# Altium project SpectrumAnalizer.PrjPcb (part 1 of 2)
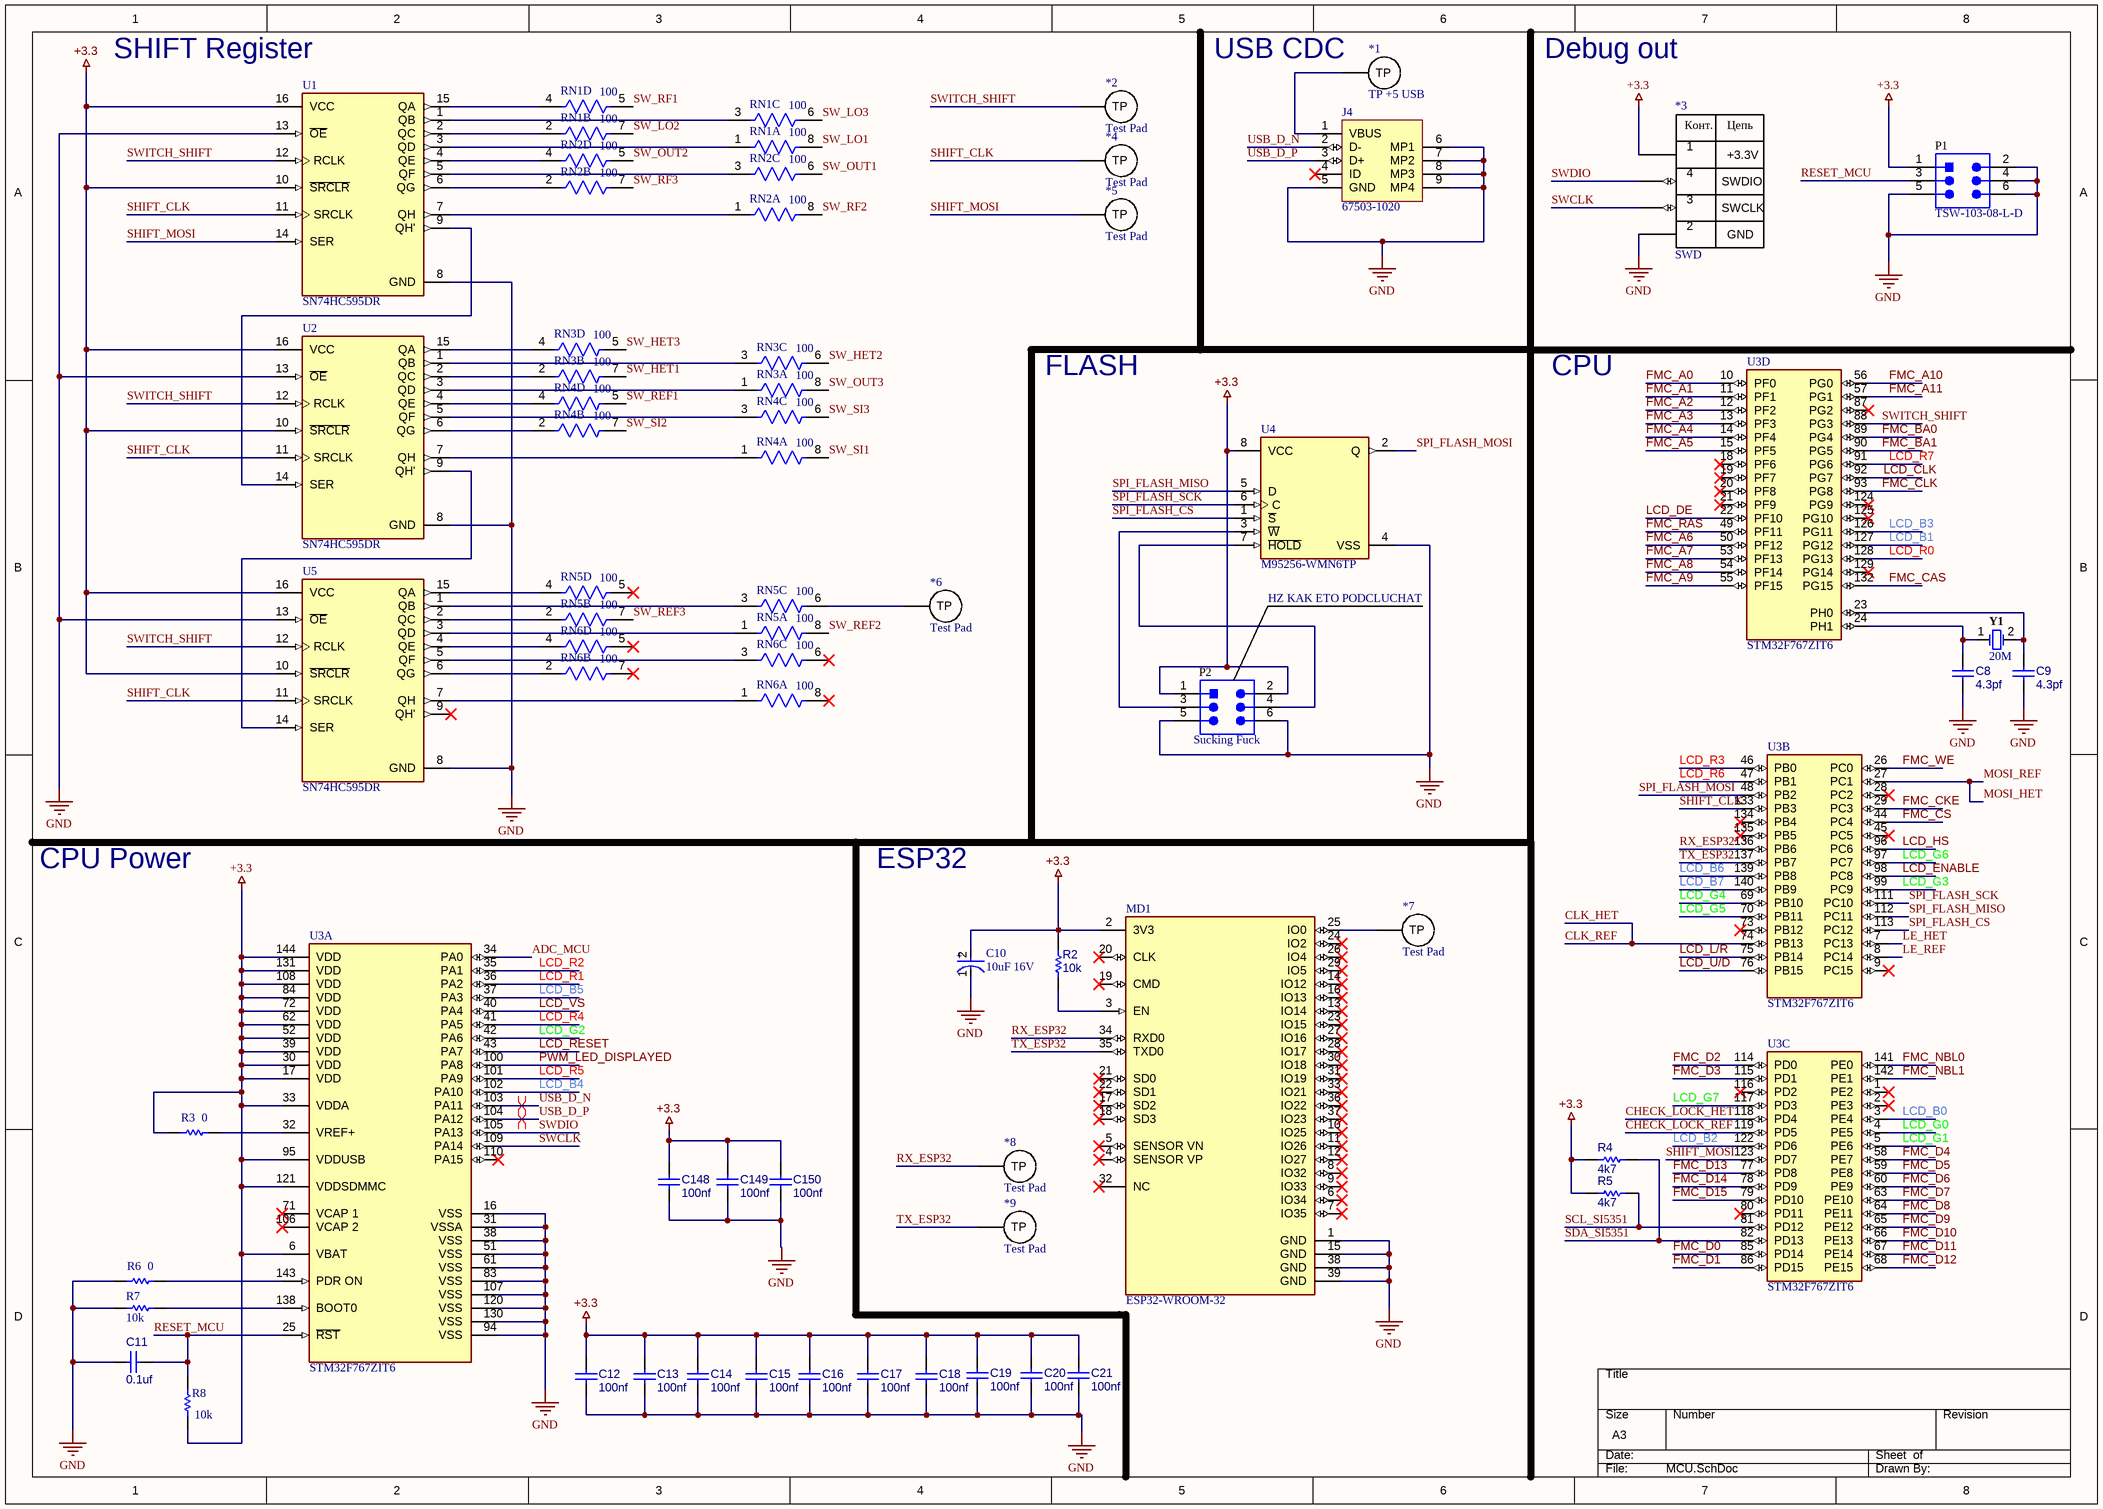
[diagram p0: MCU.SchDoc]
4 sheets, 289 parts. Net scope: global (net labels, ports and power ports of the same name join across sheets).
Board files: Main.PcbDoc, main Var2.PcbDoc
Sheets:
  MCU.SchDoc
  Power.SchDoc
  LCD.SchDoc
  Analog.SchDoc

## Sheet MCU.SchDoc
size A3

### Parts
*1  TP +5 USB  [Test Pad]
*2  Test Pad  [Test Pad]
*3  SWD  [PCBComponent_1]
*4  Test Pad  [Test Pad]
*5  Test Pad  [Test Pad]
*6  Test Pad  [Test Pad]
*7  Test Pad  [Test Pad]
*8  Test Pad  [Test Pad]
*9  Test Pad  [Test Pad]
C8  4.3pf  [CAPC2013X70X45NL10T25]
C9  4.3pf  [CAPC2013X70X45NL10T25]
C10  10uF 16V  [FP-TAJA-MFG]
C11  0.1uf  [CAPC2013X70X45NL10T25]
C12  100nf  [CAPC2013X70X45NL10T25]
C13  100nf  [CAPC2013X70X45NL10T25]
C14  100nf  [CAPC2013X70X45NL10T25]
C15  100nf  [CAPC2013X70X45NL10T25]
C16  100nf  [CAPC2013X70X45NL10T25]
C17  100nf  [CAPC2013X70X45NL10T25]
C18  100nf  [CAPC2013X70X45NL10T25]
C19  100nf  [CAPC2013X70X45NL10T25]
C20  100nf  [CAPC2013X70X45NL10T25]
C21  100nf  [CAPC2013X70X45NL10T25]
C148  100nf  [CAPC2013X70X45NL10T25]
C149  100nf  [CAPC2013X70X45NL10T25]
C150  100nf  [CAPC2013X70X45NL10T25]
J4  67503-1020  [MOLX-67503-1020_V]
MD1  ESP32-WROOM-32  [FP-ESP32-WROOM-32-MFG]
P1  TSW-103-08-L-D  [SMTC-TSW-103-08-L-D_V]
P2  Sucking Fuck  [SMTC-TSW-103-08-L-D_V]
R2  10k  [RESC2013X60X35ML10T20]
R3  0  [RESC2013X60X35ML10T20]
R4  4k7  [RESC2013X60X35ML10T20]
R5  4k7  [RESC2013X60X35ML10T20]
R6  0  [RESC2013X60X35ML10T20]
R7  10k  [RESC2013X60X35ML10T20]
R8  10k  [RESC2013X60X35ML10T20]
RN1  100  [FP-742C083-MFG]  (parts A,B,C,D of 4)
RN2  100  [FP-742C083-MFG]  (parts A,B,C,D of 4)
RN3  100  [FP-742C083-MFG]  (parts A,B,C,D of 4)
RN4  100  [FP-742C083-MFG]  (parts A,B,C,D of 4)
RN5  100  [FP-742C083-MFG]  (parts A,B,C,D of 4)
RN6  100  [FP-742C083-MFG]  (parts A,B,C,D of 4)
U1  SN74HC595DR  [FP-D0016A-MFG]
U2  SN74HC595DR  [FP-D0016A-MFG]
U3  STM32F767ZIT6  [FP-LQFP144-1A-MFG]  (parts A,B,C,D of 4)
U4  M95256-WMN6TP  [FP-SO8N-SO-A-MFG]
U5  SN74HC595DR  [FP-D0016A-MFG]
Y1  20M  [FOX-FOXSLF-2_V]

### Nets
+3.3: *3.1(+3.3V) C10.2(A) C12.2 C13.2 C14.2 C15.2 C16.2 C17.2 C18.2 C19.2 C20.2 C21.2 C148.2 C149.2 C150.2 MD1.2(3V3) P1.1 P2.1 P2.2 R2.2 R3.2 R4.2 R5.2 R8.1 U1.10(~{SRCLR}) U1.16(VCC) U2.10(~{SRCLR}) U2.16(VCC) U3.6(VBAT) U3.17(VDD) U3.30(VDD) U3.33(VDDA) U3.39(VDD) U3.52(VDD) U3.62(VDD) U3.72(VDD) U3.84(VDD) U3.95(VDDUSB) U3.108(VDD) U3.121(VDDSDMMC) U3.131(VDD) U3.144(VDD) U4.8(VCC) U5.10(~{SRCLR}) U5.16(VCC)
GND: *3.2(GND) C8.2 C9.2 C10.1(C) C11.2 C12.1 C13.1 C14.1 C15.1 C16.1 C17.1 C18.1 C19.1 C20.1 C21.1 C148.1 C149.1 C150.1 J4.5(GND) J4.6(MP1) J4.7(MP2) J4.8(MP3) J4.9(MP4) MD1.1(GND) MD1.15(GND) MD1.38(GND) MD1.39(GND) P1.2 P1.4 P1.5 P1.6 P2.5 P2.6 R6.2 R7.2 U1.8(GND) U1.13(~{OE}) U2.8(GND) U2.13(~{OE}) U3.16(VSS) U3.31(VSSA) U3.38(VSS) U3.51(VSS) U3.61(VSS) U3.83(VSS) U3.94(VSS) U3.107(VSS) U3.120(VSS) U3.130(VSS) U4.4(VSS) U5.8(GND) U5.13(~{OE})
ADC_MCU: U3.34(PA0)
CHECK_LOCK_HET: U3.118(PD4)
CHECK_LOCK_REF: U3.119(PD5)
CLK_HET: U3.74(PB13)  [also labelled CLK_REF]
FMC_A0: U3.10(PF0)
FMC_A1: U3.11(PF1)
FMC_A2: U3.12(PF2)
FMC_A3: U3.13(PF3)
FMC_A4: U3.14(PF4)
FMC_A5: U3.15(PF5)
FMC_A6: U3.50(PF12)
FMC_A7: U3.53(PF13)
FMC_A8: U3.54(PF14)
FMC_A9: U3.55(PF15)
FMC_A10: U3.56(PG0)
FMC_A11: U3.57(PG1)
FMC_BA0: U3.89(PG4)
FMC_BA1: U3.90(PG5)
FMC_CAS: U3.132(PG15)
FMC_CKE: U3.29(PC3)
FMC_CLK: U3.93(PG8)
FMC_CS: U3.44(PC4)
FMC_D0: U3.85(PD14)
FMC_D1: U3.86(PD15)
FMC_D2: U3.114(PD0)
FMC_D3: U3.115(PD1)
FMC_D4: U3.58(PE7)
FMC_D5: U3.59(PE8)
FMC_D6: U3.60(PE9)
FMC_D7: U3.63(PE10)
FMC_D8: U3.64(PE11)
FMC_D9: U3.65(PE12)
FMC_D10: U3.66(PE13)
FMC_D11: U3.67(PE14)
FMC_D12: U3.68(PE15)
FMC_D13: U3.77(PD8)
FMC_D14: U3.78(PD9)
FMC_D15: U3.79(PD10)
FMC_NBL0: U3.141(PE0)
FMC_NBL1: U3.142(PE1)
FMC_RAS: U3.49(PF11)
FMC_WE: U3.26(PC0)
LCD_B0: U3.3(PE4)
LCD_B1: U3.127(PG12)
LCD_B2: U3.122(PD6)
LCD_B3: U3.126(PG11)
LCD_B4: U3.102(PA10)
LCD_B5: U3.37(PA3)
LCD_B6: U3.139(PB8)
LCD_B7: U3.140(PB9)
LCD_CLK: U3.92(PG7)
LCD_DE: U3.22(PF10)
LCD_ENABLE: U3.98(PC8)
LCD_G0: U3.4(PE5)
LCD_G1: U3.5(PE6)
LCD_G2: U3.42(PA6)
LCD_G3: U3.99(PC9)
LCD_G4: U3.69(PB10)
LCD_G5: U3.70(PB11)
LCD_G6: U3.97(PC7)
LCD_G7: U3.117(PD3)
LCD_HS: U3.96(PC6)
LCD_L/R: U3.75(PB14)
LCD_R0: U3.128(PG13)
LCD_R1: U3.36(PA2)
LCD_R2: U3.35(PA1)
LCD_R3: U3.46(PB0)
LCD_R4: U3.41(PA5)
LCD_R5: U3.101(PA9)
LCD_R6: U3.47(PB1)
LCD_R7: U3.91(PG6)
LCD_RESET: U3.43(PA7)
LCD_U/D: U3.76(PB15)
LCD_VS: U3.40(PA4)
LE_HET: U3.7(PC13)
LE_REF: U3.8(PC14)
MOSI_HET: U3.27(PC1)  [also labelled MOSI_REF]
PWM_LED_DISPLAYED: U3.100(PA8)
RESET_MCU: C11.1 P1.3 R8.2 U3.25(~{RST})
RX_ESP32: *8.1(TP) MD1.34(RXD0) U3.136(PB6)
SCL_SI5351: R5.1 U3.81(PD12)
SDA_SI5351: R4.1 U3.82(PD13)
SHIFT_CLK: *4.1(TP) U1.11(SRCLK) U2.11(SRCLK) U3.133(PB3) U5.11(SRCLK)
SHIFT_MOSI: *5.1(TP) U1.14(SER) U3.123(PD7)
SPI_FLASH_CS: U3.113(PC12) U4.1(~{S})
SPI_FLASH_MISO: U3.112(PC11) U4.5(D)
SPI_FLASH_MOSI: U3.48(PB2) U4.2(Q)
SPI_FLASH_SCK: U3.111(PC10) U4.6(C)
SW_HET1: RN3.7
SW_HET2: RN3.6
SW_HET3: RN3.5
SW_LO1: RN1.8
SW_LO2: RN1.7
SW_LO3: RN1.6
SW_OUT1: RN2.6
SW_OUT2: RN2.5
SW_OUT3: RN3.8
SW_REF1: RN4.5
SW_REF2: RN5.8
SW_REF3: RN5.7
SW_RF1: RN1.5
SW_RF2: RN2.8
SW_RF3: RN2.7
SW_SI1: RN4.8
SW_SI2: RN4.7
SW_SI3: RN4.6
SWCLK: *3.3(SWCLK) U3.109(PA14)
SWDIO: *3.4(SWDIO) U3.105(PA13)
SWITCH_SHIFT: *2.1(TP) U1.12(RCLK) U2.12(RCLK) U3.88(PG3) U5.12(RCLK)
TX_ESP32: *9.1(TP) MD1.35(TXD0) U3.137(PB7)
USB_D_N: J4.2(D-) U3.103(PA11)
USB_D_P: J4.3(D+) U3.104(PA12)
Net*1_1: *1.1(TP) J4.1(VBUS)
Net*6_1: *6.1(TP) RN5.6
Net*7_1: *7.1(TP) MD1.25(IO0)
NetC8_1: C8.1 U3.24(PH1) Y1.1
NetC9_1: C9.1 U3.23(PH0) Y1.2
NetMD1_3: MD1.3(EN) R2.1
NetP2_3: P2.3 U4.3(~{W})
NetP2_4: P2.4 U4.7(~{HOLD})
NetR3_1: R3.1 U3.32(VREF+)
NetR6_1: R6.1 U3.143(PDR_ON)
NetR7_1: R7.1 U3.138(BOOT0)
NetRN1_1: RN1.1 U1.3(QD)
NetRN1_2: RN1.2 U1.2(QC)
NetRN1_3: RN1.3 U1.1(QB)
NetRN1_4: RN1.4 U1.15(QA)
NetRN2_1: RN2.1 U1.7(QH)
NetRN2_2: RN2.2 U1.6(QG)
NetRN2_3: RN2.3 U1.5(QF)
NetRN2_4: RN2.4 U1.4(QE)
NetRN3_1: RN3.1 U2.3(QD)
NetRN3_2: RN3.2 U2.2(QC)
NetRN3_3: RN3.3 U2.1(QB)
NetRN3_4: RN3.4 U2.15(QA)
NetRN4_1: RN4.1 U2.7(QH)
NetRN4_2: RN4.2 U2.6(QG)
NetRN4_3: RN4.3 U2.5(QF)
NetRN4_4: RN4.4 U2.4(QE)
NetRN5_1: RN5.1 U5.3(QD)
NetRN5_2: RN5.2 U5.2(QC)
NetRN5_3: RN5.3 U5.1(QB)
NetRN5_4: RN5.4 U5.15(QA)
NetRN6_1: RN6.1 U5.7(QH)
NetRN6_2: RN6.2 U5.6(QG)
NetRN6_3: RN6.3 U5.5(QF)
NetRN6_4: RN6.4 U5.4(QE)
NetU1_9: U1.9(QH') U2.14(SER)
NetU2_9: U2.9(QH') U5.14(SER)

Not connected (* = marked no-connect by the designer): J4 4(ID)*; MD1 4(SENSOR_VP)* 5(SENSOR_VN)* 6(IO34)* 7(IO35)* 8(IO32)* 9(IO33)* 10(IO25)* 11(IO26)* 12(IO27)* 13(IO14)* 14(IO12)* 16(IO13)* 17(SD2)* 18(SD3)* 19(CMD)* 20(CLK)* 21(SD0)* 22(SD1)* 23(IO15)* 24(IO2)* 26(IO4)* 27(IO16)* 28(IO17)* 29(IO5)* 30(IO18)* 31(IO19)* 32(NC)* 33(IO21)* 36(IO22)* 37(IO23)*; RN5 5*; RN6 5* 6* 7* 8*; U3 1(PE2)* 2(PE3)* 9(PC15)* 18(PF6)* 19(PF7)* 20(PF8)* 21(PF9)* 28(PC2)* 45(PC5)* 71(VCAP_1)* 73(PB12)* 80(PD11)* 87(PG2)* 106(VCAP_2)* 110(PA15)* 116(PD2)* 124(PG9)* 125(PG10)* 129(PG14)* 134(PB4)* 135(PB5)*; U5 9(QH')*

### Layout directives
differential pair: USB_D_N, USB_D_P

### Notes on the sheet
- (near U1) SHIFT Register
- USB CDC
- Debug out
- FLASH
- CPU
- (near U4) HZ KAK ETO PODCLUCHAT
- CPU Power
- ESP32
- (in symbol CMP-04424-000155-1) +
- (in symbol SWD) Конт.; Цепь

### Library data of the parts
*1 = Test Pad
C8 C9 C11-C21 C148-C150 = CMP-2007-00957-1: Part Number: GRM216R61E105KA12D; Manufacturer: Murata
C10 = CMP-04424-000155-1: 3.3uF 25V  ±20% 3.7Ω 1206  SMD Tantalum Capacitor; Dissipation Factor: 6%; Leakage Current: 800nA; Polarity: Polar; ESR (Equivalent Series Resistance): 3.7R; Height - Seated (Max): 0.071inch; Mount: Surface Mount; Packaging: Tape and Reel; Case Code (Metric): 3216; RoHS Compliant: Yes; Tolerance: 20%; Voltage Rating (DC): 25V; Voltage Rating: 25V; Weight: 0.000571oz; Package Quantity: 2000; Series: TAJ; Height: 1.8mm; Case/Package: 1206; Capacitance: 3.3uF; Number of Pins: 2; Max Operating Temperature: 125°C; Construction: Flat; Width: 1.6mm; Lead Free: Lead Free; Depth: 1.6mm; Termination: SMD/SMT; Min Operating Temperature: -55°C; Case Code (Imperial): 1206; Length: 3.2mm; Radiation Hardening: No; Features: General Purpose
J4 = CMP-0411-00002-1: USB, MINI, SMD, RA KME04-USBMU03A01; Manufacturer: Molex; ComponentLink1URL: http://www.molex.com/; PartNumber: 67503-1020; Mounting Technology: Surface Mount; ComponentLink1Description: Manufacturer URL; Terminal Pitch: 0.8 mm; DatasheetVersion: Rev F, 06/2009; ComponentLink2Description: Datasheet; PackageDescription: Mini USB Connector, SMT, Righer Angle; ComponentLink2URL: http://www.molex.com/pdm_docs/sd/675031020_sd.pdf; PackageReference: 67503-1020
MD1 = CMP-194065-000008-1: RX TXRX MOD WIFI SURFACE MOUNT; Frequency: 2.5GHz; Sensitivity: -98dBm; Operating Supply Voltage: 3.6V; Data Rate: 150Mbps; Weight: 0.088185oz; Package Quantity: 550; Min Operating Temperature: -40°C; Mount: Surface Mount; Max Operating Temperature: 85°C; Packaging: Cut Tape; Case/Package: SMD/SMT
P1 P2 = CMP-1024-00336-5: Male Header, Pitch 2.54 mm, 2 x 3 Position, Height 8.38 mm, Tail Length 5.08 mm, -55 to 125 degC, RoHS, Bulk; Manufacturer: Samtec; DatasheetVersion: 04/2012; ComponentLink3URL: http://suddendocs.samtec.com/prints/tsw-xxx-xx-x-x-xx-xxx-footprint.pdf; PackageReference: TSW-103-08-L-D; Mounting Technology: Through Hole; Min Operating Temperature: -55 degC; ComponentLink2Description: Datasheet; Lead Pitch: 2.54 mm; ComponentLink1Description: Manufacturer URL; Mount: Through Hole; ComponentLink1URL: http://www.samtec.com/; ComponentLink3Description: Package Specification; Max Operating Temperature: 125 degC; PackageDescription: Male Header, Pitch 2.54 mm, 2 x 3 Position, Height 8.38 mm, Tail Length 5.08 mm; ComponentLink2URL: https://datasheet.ciiva.com/25618/0900766b81154476-25618436.pdf; RoHSCompliant: true
R2-R8 = CMP-2100-03671-1: Chip Resistor, 1 KOhm, +/- 1%, 125 mW, -55 to 155 degC, 0805 (2012 Metric), RoHS, Tape and Reel; Manufacturer: Yageo; Temperature Coefficient: 100ppm/degreesC; Voltage Rating (DC): 150V; Max Power Dissipation: 125mW; Resistance: 1KOhm; Number of Pins: 2; Number of Terminations: 2; Datasheet URL: http://www.yageo.com/NewPortal/yageodocoutput?fileName=/pdf/R-Chip/PYu-RC_Group_51_RoHS_L_5.pdf; Length: 0.079inch; Package Description: 2-Pin Surface Mounted Device, Body 2 x 1.25 mm; Depth: 1.25mm; Height: 0.024inch; Military Standard: Not; Case/Package: 0805; Package Reference: 0805; RoHSCompliant: true; Lead Free: LeadFree; Packaging: TapeandReel; Package Quantity: 1; Datasheet Version: Rev. 5, 10/2016; Tolerance: 1%; Min Operating Temperature: -55degC; Voltage Rating: 150V; Composition: ThickFilm; Case Code (Imperial): 0805; Power Rating: 125mW; Width: 0.049inch; Case Code (Metric): 2012; Manufacturer URL: http://www.yageo.com/; Max Operating Temperature: 155degC; REACH SVHC: Unknown; Termination: SMD/SMT
RN1-RN6 = CMP-06828-000007-1: RES ARRAY 4 RES 22 OHM 1206; Power Dissipation: 63mW; Tolerance: 5%; Resistance: 22R; Number of Resistors: 4; Voltage Rating: 50V; Circuit Type: Isolated; Power Rating: 250mW; Temperature Coefficient: 200ppm/°C; Depth: 1.6mm; Number of Terminals: 8; Contact Plating: Tin; Height: 0.6mm; Terminal Pitch: 0.8mm; Mount: Surface Mount; Min Operating Temperature: -55°C; Military Standard: Not; Power Per Element: 63mW; Max Operating Temperature: 125°C; Length: 3.2mm; Number of Elements: 4; Package Quantity: 5000; Number of Pins: 8; Radiation Hardening: No; Packaging: Tape and Reel; Termination: Concave; Lead Free: Lead Free; Case/Package: Molded
U1 U2 U5 = CMP-0780-00037-4: IC 8BIT SHIFT REG 3ST-OUT 16SOIC; Manufacturer: Texas Instruments; Max Supply Voltage: 6V; Nominal Supply Current: 80uA; Number Of Circuits: 1; Max Junction Temp: +150°C; Propagation Delay: 43ns; Frequency: 29MHz; Min Supply Voltage: 2V; Standoff Height: 0.1mm; Number Of Outputs: 9; Height: 1.75mm; Automotive: No; Device Class L1: Integrated Circuits (ICs); ComponentLink2Description: Datasheet; Ambient Temperature Range Low: -40°C; Ambient Temperature Range High: +85°C; Digikey Description: IC 8BIT SHIFT REG 3ST-OUT 16SOIC; ComponentLink2URL: http://www.ti.com/lit/ds/symlink/sn74hc595.pdf; Package: D0016A; Lead Free: Yes; Manufacturer Part Number: SN74HC595DR; Device Class L3: Shift Registers; Category: IC; Number Of Inputs: 1; Octopart: https://octopart.com/sn74hc595dr-texas+instruments-500634; Ipc Land Pattern Name: SOIC127P600X175-16; Device Class L2: Logic ICs; Temperature Range Low: -40°C; RoHS: TRUE; Temperature: -40°C to +85°C; Temperature Range High: +85°C; Mouser Description: Counter Shift Registers 8bit Shift
U3 = CMP-12105-000074-1: IC MCU 32BIT 2MB FLASH 144LQFP; Manufacturer: STMicroelectronics; Ram Size: 512KBytes; Number Of I/Os: 114; Core Architecture: ARM Cortex-M7; Memory Size: 2048KBytes; Standoff Height: 0.05mm; Number Of Adc Channels: 24; Max Supply Voltage: 3.6V; Number Of Pwm Channels: 4; Min Supply Voltage: 1.7V; Max Junction Temp: +105°C; Number Of Timers/Counters: 15; Number Of Usb Channels: 1; Interface: I2C,SPI,UART,USART,EBI/EMI,CAN,USB,LIN,IrDA,Ethernet,I2S; Frequency: 216MHz; Data Bus Width: 32bits; Number Of Spi Channels: 6; Number Of A/D Converters: 3; Octopart: https://octopart.com/stm32f767zit6-stmicroelectronics-70527068; Category: IC; Device Class L2: Embedded Processors and Controllers; Package: LQFP144-1A; RoHS: TRUE; Digikey Description: IC MCU 32BIT 2MB FLASH 144LQFP; ComponentLink2Description: Datasheet; Automotive: No; Mouser Description: ARM Microcontrollers - MCU High-performance and DSP with FPU, ARM Cortex-M7 MCU with 2 Mbytes Flash, 216 MHz CPU, Art Accelerator, L1 cache, SDRAM,; Ambient Temperature Range Low: -40°C; Ambient Temperature Range High: +85°C; Memory Type: FLASH; ComponentLink2URL: https://www.st.com/resource/en/datasheet/stm32f767zi.pdf; Number Of Uart Channels: 4; Temperature: -40°C to +85°C; Device Class L3: Microcontrollers; Device Class L1: Integrated Circuits (ICs); Temperature Range Low: -40°C; Temperature Range High: +85°C; Lead Free: Yes; Number Of I2C Channels: 4; Number Of Ethernet Channels: 1; Height: 1.6mm; Number Of Cores: 1; Manufacturer Part Number: STM32F767ZIT6; Ipc Land Pattern Name: QFP50P2200X2200X160-144
U4 = CMP-12142-000008-1: IC EEPROM 256K SPI 20MHZ 8SO; Manufacturer: STMicroelectronics; Memory Size: 256Kbits; Max Supply Voltage: 5.5V; Min Supply Voltage: 2.5V; Access Time: 60ns; Nominal Supply Current: 2-5mA; Standoff Height: 0.1mm; Package: SO8N-SO-A; Height: 1.75mm; Ipc Land Pattern Name: SOIC127P600X175-8; Lead Free: Yes; Device Class L3: EEPROM; Octopart: https://octopart.com/m95256-wmn6tp-stmicroelectronics-842801; Automotive: No; ComponentLink2Description: Datasheet; Frequency: 20MHz; Device Class L2: Memory; Temperature Range Low: -40°C; Temperature: -40°C to +85°C; Device Class L1: Integrated Circuits (ICs); Memory Type: EEPROM; Ambient Temperature Range High: +85°C; Digikey Description: IC EEPROM 256K SPI 20MHZ 8SO; ComponentLink2URL: https://www.st.com/resource/en/datasheet/m95256-w.pdf; Interface: SPI; Temperature Range High: +85°C; Manufacturer Part Number: M95256-WMN6TP; Mouser Description: EEPROM 2.5 V to 5.5V 256k; Ambient Temperature Range Low: -40°C; RoHS: TRUE; Category: IC
Y1 = CMP-1749-00004-1: Resistance Weld Thru-Hole Crystal, 12 MHz, +/-30 ppm, -20 to 70 degC, 2-Pin THD, RoHS, Bulk; Elements: 1; Rds On Max: 115 mohm; Typical Rise Time: 90 ns; Max Power Dissipation: 2.5 W; Case\Package: TO-251-3; Input Capacitance: 350 pF; REACH SVHC: No SVHC; Length: 6.6 mm; ComponentLink1URL: http://www.foxonline.com/; PackageDescription: 2-Pin Through Hole Device, Body 11.35 x 4.65 mm, Pitch 4.88 mm; Radiation Hardening: No; Package Quantity: 70; Packaging: Rail/Tube; ComponentLink1Description: Manufacturer URL; Min Operating Temperature: -55 degC; Max Operating Temperature: 150 degC; RoHSCompliant: true; PackageReference: FOXSLF-2; DatasheetVersion: Mar-15; Pins: 3; Height: 6.1 mm; Mount: Through Hole; ComponentLink2URL: http://www.foxonline.com/pdfs/hc49slf.pdf; ComponentLink2Description: Datasheet; Width: 2.3 mm

## Sheet Power.SchDoc
size A3
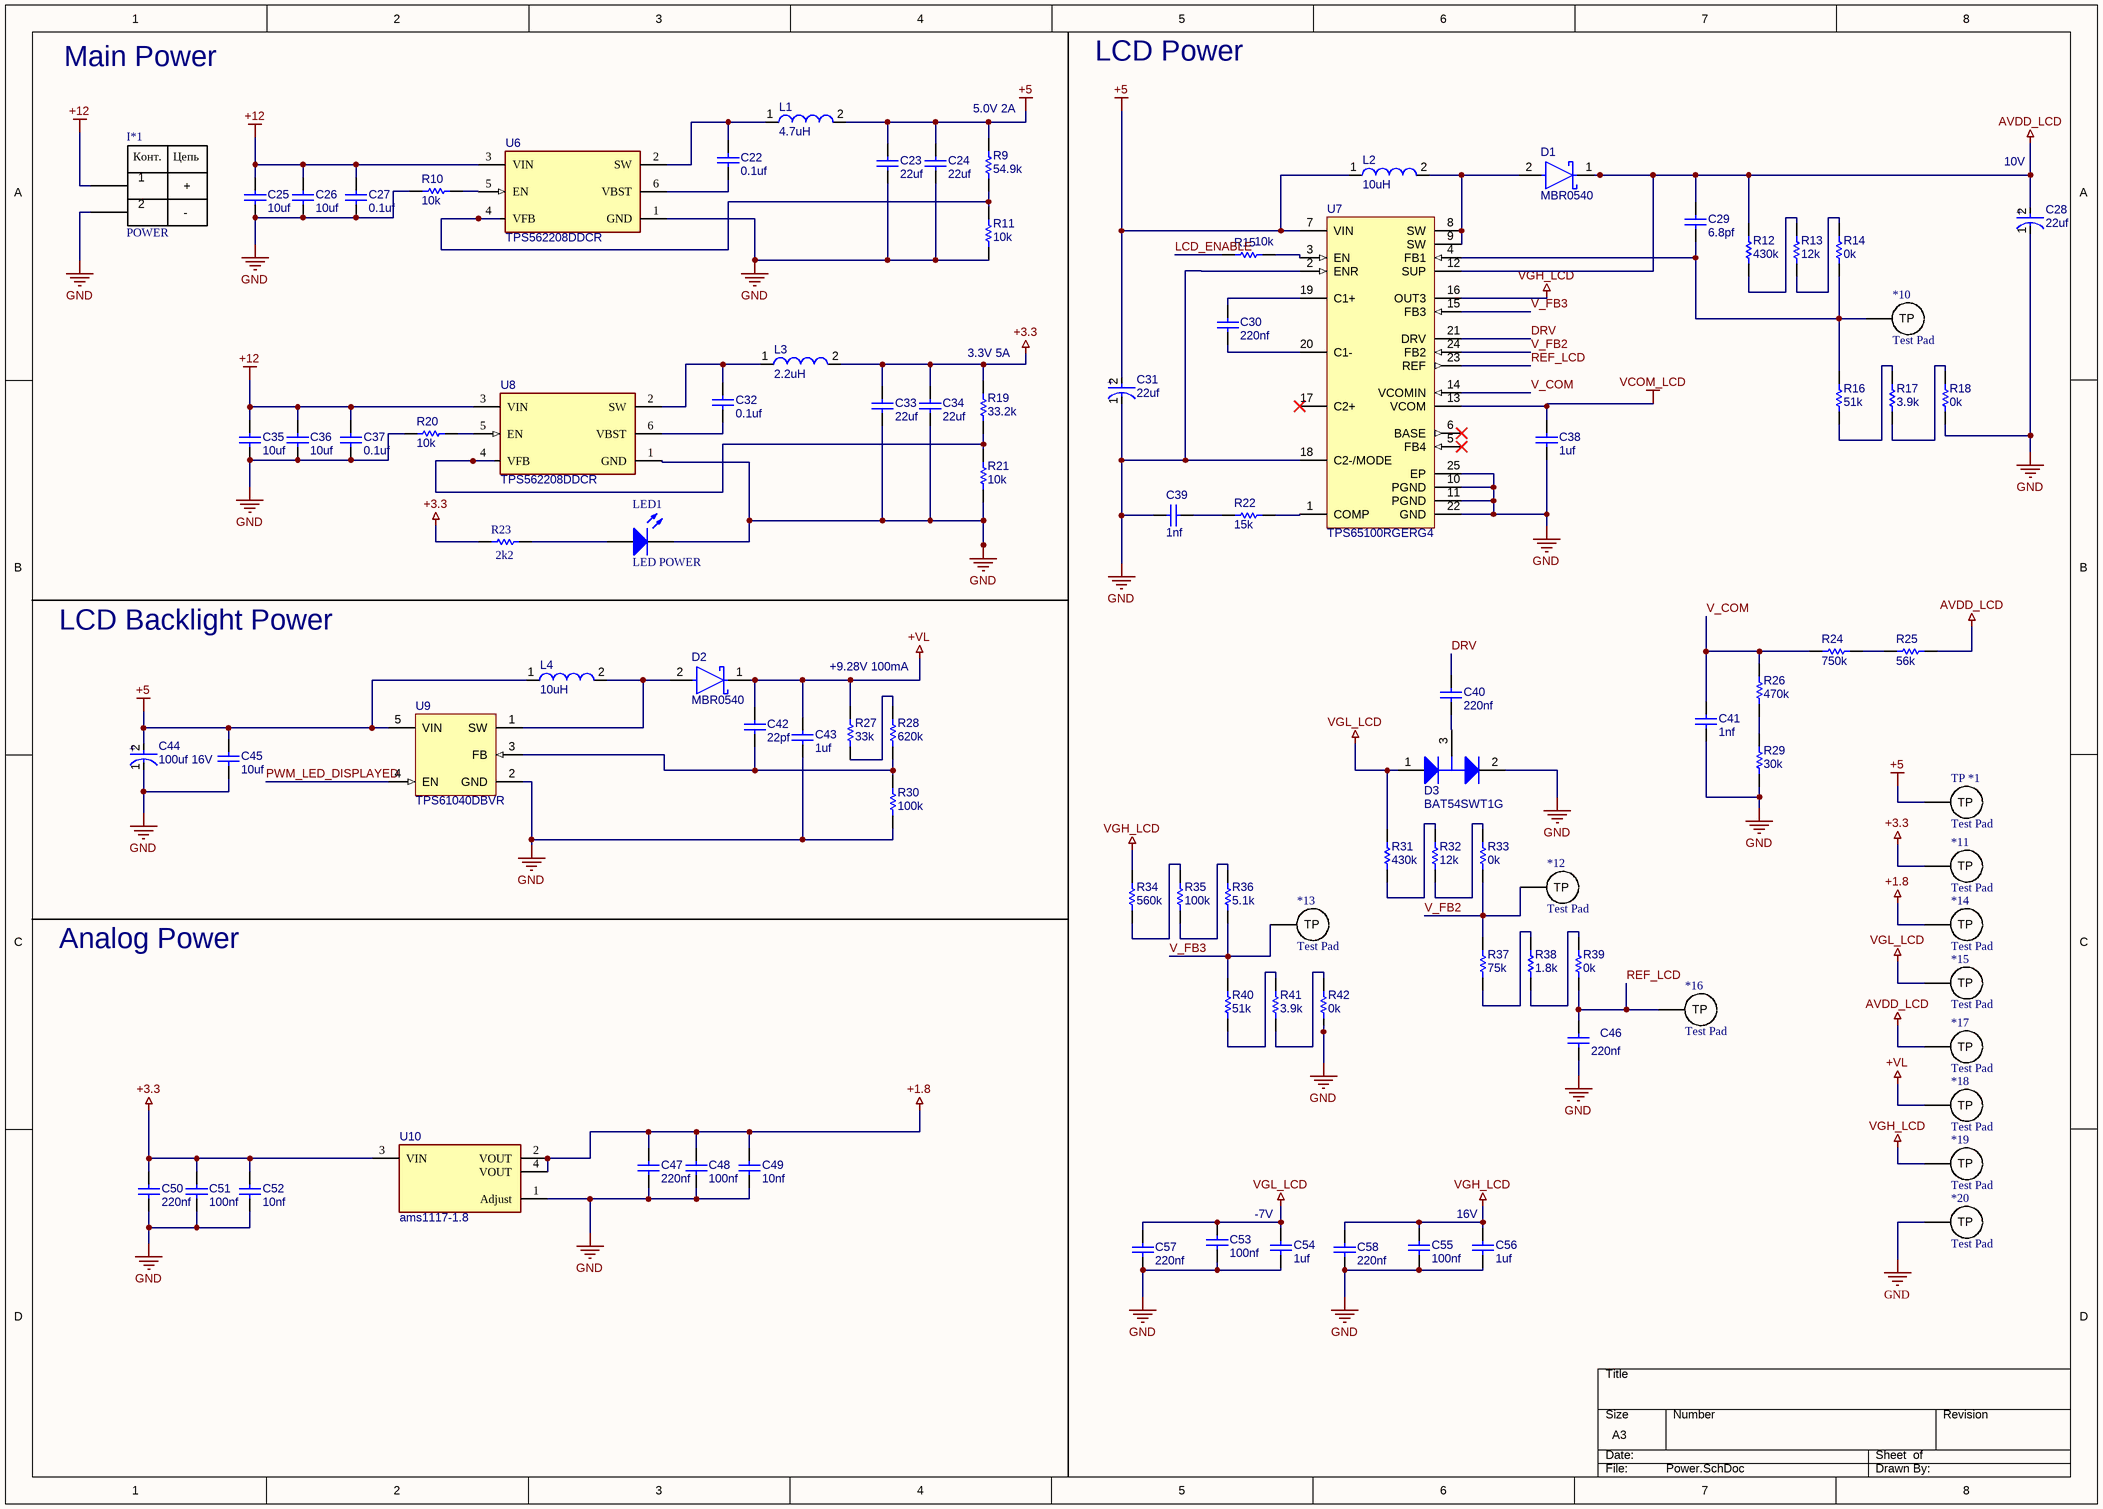
[diagram p1: Power.SchDoc]

### Parts
*10  Test Pad  [Test Pad]
*11  Test Pad  [Test Pad]
*12  Test Pad  [Test Pad]
*13  Test Pad  [Test Pad]
*14  Test Pad  [Test Pad]
*15  Test Pad  [Test Pad]
*16  Test Pad  [Test Pad]
*17  Test Pad  [Test Pad]
*18  Test Pad  [Test Pad]
*19  Test Pad  [Test Pad]
*20  Test Pad  [Test Pad]
C22  0.1uf  [CAPC2013X70X45NL10T25]
C23  22uf  [CAPC2013X70X45NL10T25]
C24  22uf  [CAPC2013X70X45NL10T25]
C25  10uf  [CAPC2013X70X45NL10T25]
C26  10uf  [CAPC2013X70X45NL10T25]
C27  0.1uf  [CAPC2013X70X45NL10T25]
C28  22uf  [FP-TAJD-MFG]
C29  6.8pf  [CAPC2013X70X45NL10T25]
C30  220nf  [CAPC2013X70X45NL10T25]
C31  22uf  [FP-TAJD-MFG]
C32  0.1uf  [CAPC2013X70X45NL10T25]
C33  22uf  [CAPC2013X70X45NL10T25]
C34  22uf  [CAPC2013X70X45NL10T25]
C35  10uf  [CAPC2013X70X45NL10T25]
C36  10uf  [CAPC2013X70X45NL10T25]
C37  0.1uf  [CAPC2013X70X45NL10T25]
C38  1uf  [CAPC2013X70X45NL10T25]
C39  1nf  [CAPC2013X70X45NL10T25]
C40  220nf  [CAPC2013X70X45NL10T25]
C41  1nf  [CAPC2013X70X45NL10T25]
C42  22pf  [CAPC2013X70X45NL10T25]
C43  1uf  [CAPC2013X70X45NL10T25]
C44  100uf 16V  [FP-T491D107K016AT-MFG]
C45  10uf  [CAPC2013X70X45NL10T25]
C46  220nf  [CAPC2013X70X45NL10T25]
C47  220nf  [CAPC2013X70X45NL10T25]
C48  100nf  [CAPC2013X70X45NL10T25]
C49  10nf  [CAPC2013X70X45NL10T25]
C50  220nf  [CAPC2013X70X45NL10T25]
C51  100nf  [CAPC2013X70X45NL10T25]
C52  10nf  [CAPC2013X70X45NL10T25]
C53  100nf  [CAPC2013X70X45NL10T25]
C54  1uf  [CAPC2013X70X45NL10T25]
C55  100nf  [CAPC2013X70X45NL10T25]
C56  1uf  [CAPC2013X70X45NL10T25]
C57  220nf  [CAPC2013X70X45NL10T25]
C58  220nf  [CAPC2013X70X45NL10T25]
D1  MBR0540  [FP-425-04-MFG]
D2  MBR0540  [FP-425-04-MFG]
D3  BAT54SWT1G  [ONSC-SOT-323-3-419-04_V]
I*1  POWER  [POWER]
L1  4.7uH  [WE-TPC-4818-M]
L2  10uH  [WE-PD2-S]
L3  2.2uH  [WE-TPC-4818-M]
L4  10uH  [WE-TPC-4818-M]
LED1  LED POWER  [0805_A]
R9  54.9k  [RESC2013X60X35ML10T20]
R10  10k  [RESC2013X60X35ML10T20]
R11  10k  [RESC2013X60X35ML10T20]
R12  430k  [RESC2013X60X35ML10T20]
R13  12k  [RESC2013X60X35ML10T20]
R14  0k  [RESC2013X60X35ML10T20]
R15  10k  [RESC2013X60X35ML10T20]
R16  51k  [RESC2013X60X35ML10T20]
R17  3.9k  [RESC2013X60X35ML10T20]
R18  0k  [RESC2013X60X35ML10T20]
R19  33.2k  [RESC2013X60X35ML10T20]
R20  10k  [RESC2013X60X35ML10T20]
R21  10k  [RESC2013X60X35ML10T20]
R22  15k  [RESC2013X60X35ML10T20]
R23  2k2  [RESC1608X50X30NL20T20]
R24  750k  [RESC2013X60X35ML10T20]
R25  56k  [RESC2013X60X35ML10T20]
R26  470k  [RESC2013X60X35ML10T20]
R27  33k  [RESC2013X60X35ML10T20]
R28  620k  [RESC2013X60X35ML10T20]
R29  30k  [RESC2013X60X35ML10T20]
R30  100k  [RESC2013X60X35ML10T20]
R31  430k  [RESC2013X60X35ML10T20]
R32  12k  [RESC2013X60X35ML10T20]
R33  0k  [RESC2013X60X35ML10T20]
R34  560k  [RESC2013X60X35ML10T20]
R35  100k  [RESC2013X60X35ML10T20]
R36  5.1k  [RESC2013X60X35ML10T20]
R37  75k  [RESC2013X60X35ML10T20]
R38  1.8k  [RESC2013X60X35ML10T20]
R39  0k  [RESC2013X60X35ML10T20]
R40  51k  [RESC2013X60X35ML10T20]
R41  3.9k  [RESC2013X60X35ML10T20]
R42  0k  [RESC2013X60X35ML10T20]
TP_*1  Test Pad  [Test Pad]
U6  TPS562208DDCR  [FP-DDC0006A-IPC_A]
U7  TPS65100RGERG4  [TI-RGE24-2450X2450TP_V]
U8  TPS562208DDCR  [FP-DDC0006A-IPC_A]
U9  TPS61040DBVR  [DBV0005A_N]
U10  ams1117-1.8  [FP-ams1117-IPC_C]

### Nets
+1.8: *14.1(TP) C47.2 C48.2 C49.2 U10.2(VOUT) U10.4(VOUT)
+3.3: *11.1(TP) C33.2 C34.2 C50.2 C51.2 C52.2 L3.2 R19.2 R23.1 U10.3(VIN)
+5: C23.2 C24.2 C31.2(A) C44.2(A) C45.2 L1.2 L2.1 L4.1 R9.2 TP_*1.1(TP) U7.7(VIN) U9.5(VIN)
+12: C25.2 C26.2 C27.2 C35.2 C36.2 C37.2 I*1.1(+) U6.3(VIN) U8.3(VIN)
+VL: *18.1(TP) C42.2 C43.2 D2.1(C) R27.2
AVDD_LCD: *17.1(TP) C28.2(A) C29.2 D1.1(C) R12.2 R25.1 U7.12(SUP)
GND: *20.1(TP) C23.1 C24.1 C25.1 C26.1 C27.1 C28.1(C) C31.1(C) C33.1 C34.1 C35.1 C36.1 C37.1 C38.1 C39.2 C41.1 C43.1 C44.1(C) C45.1 C46.1 C47.1 C48.1 C49.1 C50.1 C51.1 C52.1 C53.1 C54.1 C55.1 C56.1 C57.1 C58.1 D3.2(K) I*1.2(-) LED1.1(K) R10.1 R11.1 R18.1 R20.1 R21.1 R29.1 R30.1 R42.1 U6.1(GND) U7.2(ENR) U7.10(PGND) U7.11(PGND) U7.18(C2-/MODE) U7.22(GND) U7.25(EP) U8.1(GND) U9.2(GND) U10.1(Adjust)
VCOM_LCD: C38.2 U7.13(VCOM)
VGH_LCD: *19.1(TP) C55.2 C56.2 C58.2 R34.2 U7.16(OUT3)
VGL_LCD: *15.1(TP) C53.2 C54.2 C57.2 D3.1(A) R31.2
DRV: C40.2 U7.21(DRV)
LCD_ENABLE: R15.2
PWM_LED_DISPLAYED: U9.4(EN)
REF_LCD: *16.1(TP) C46.2 R39.1 U7.23(REF)
V_COM: C41.2 R24.2 R26.2 U7.14(VCOMIN)
V_FB2: *12.1(TP) R33.1 R37.2 U7.24(FB2)
V_FB3: *13.1(TP) R36.1 R40.2 U7.15(FB3)
Net*10_1: *10.1(TP) C29.1 R14.1 R16.2 U7.4(FB1)
NetC22_1: C22.1 U6.6(VBST)
NetC22_2: C22.2 L1.1 U6.2(SW)
NetC30_1: C30.1 U7.20(C1-)
NetC30_2: C30.2 U7.19(C1+)
NetC32_1: C32.1 U8.6(VBST)
NetC32_2: C32.2 L3.1 U8.2(SW)
NetC39_1: C39.1 R22.2
NetC40_1: C40.1 D3.3(K/A)
NetC42_1: C42.1 R28.1 R30.2 U9.3(FB)
NetD1_2: D1.2(A) L2.2 U7.8(SW) U7.9(SW)
NetD2_2: D2.2(A) L4.2 U9.1(SW)
NetLED1_2: LED1.2(A) R23.2
NetR9_1: R9.1 R11.2 U6.4(VFB)
NetR10_2: R10.2 U6.5(EN)
NetR12_1: R12.1 R13.2
NetR13_1: R13.1 R14.2
NetR15_1: R15.1 U7.3(EN)
NetR16_1: R16.1 R17.2
NetR17_1: R17.1 R18.2
NetR19_1: R19.1 R21.2 U8.4(VFB)
NetR20_2: R20.2 U8.5(EN)
NetR22_1: R22.1 U7.1(COMP)
NetR24_1: R24.1 R25.2
NetR26_1: R26.1 R29.2
NetR27_1: R27.1 R28.2
NetR31_1: R31.1 R32.2
NetR32_1: R32.1 R33.2
NetR34_1: R34.1 R35.2
NetR35_1: R35.1 R36.2
NetR37_1: R37.1 R38.2
NetR38_1: R38.1 R39.2
NetR40_1: R40.1 R41.2
NetR41_1: R41.1 R42.2

Not connected (* = marked no-connect by the designer): U7 5(FB4)* 6(BASE)* 17(C2+)*

### Notes on the sheet
- Main Power
- 5.0V 2A
- LCD Power
- (near C28) 10V
- (near R19) 3.3V 5A
- LCD Backlight Power
- +9.28V 100mA
- Analog Power
- (near C54) -7V
- (near C56) 16V
- (in symbol CMP-2000-07541-2) +
- (in symbol CMP-04424-000507-1) +
- (in symbol POWER) Конт.; Цепь

### Library data of the parts
C22-C27 C29 C30 C32-C43 C45-C58 = CMP-2007-00957-1: as C8 on sheet MCU
C28 C31 = CMP-04424-000507-1: 22uF 16V  ±20% 1.1Ω 2917  SMD Tantalum Capacitor; Dissipation Factor: 6%; Q Factor: 6; ESR (Equivalent Series Resistance): 1.1R; Polarity: Polar; Leakage Current: 3.5uA; Height: 3.1mm; RoHS Compliant: Yes; Series: TAJ; Min Operating Temperature: -55°C; Case/Package: 2917; Construction: Flat; Length: 7.3mm; Radiation Hardening: No; Features: General Purpose; Number of Pins: 2; Height - Seated (Max): 0.122inch; Lead Free: Lead Free; Mount: Surface Mount; REACH SVHC: No SVHC; Packaging: Tape and Reel; Voltage Rating (DC): 16V; Capacitance: 22uF; Width: 4.3mm; Voltage Rating: 16V; Case Code (Imperial): 2917; Package Quantity: 1; Tolerance: 20%; Case Code (Metric): 7343; Depth: 4.3mm; Termination: SMD/SMT; Max Operating Temperature: 125°C
C44 = CMP-2000-07541-2: CAP TANT 100UF 10% 16V 2917; Life (Hours): 2000Hour; ESR (Equivalent Series Resistance): 700mR; Polarity: Polar; Ripple Current: 463mA; Dielectric Material: Tantalum; Leakage Current: 16uA; Dissipation Factor: 8%; Case Code (Imperial): 2917; Width: 4.3mm; Lead Pitch: 3.6mm; Max Operating Temperature: 125°C; Capacitance: 100uF; Packaging: Tape and Reel; Depth: 4.3mm; Voltage Rating: 16V; Height - Seated (Max): 0.122inch; Tolerance: 10%; Voltage: 16V; Voltage Rating (DC): 16V; Length: 7.3mm; Case Code (Metric): 7343; Package Quantity: 1; RoHS Compliant: Yes; Height: 2.8mm; Weight: 0.023634oz; Radiation Hardening: No; REACH SVHC: No SVHC; Features: General Purpose; Termination: SMD/SMT; Min Operating Temperature: -55°C; Mount: Surface Mount; Lead Free: Lead Free; Case/Package: Molded
D1 D2 = CMP-2000-05114-2: DIODE SCHOTTKY 40V 500MA SOD123; Max Surge Current: 5.5A; Max Reverse Leakage Current: 20uA; Forward Voltage: 620mV; Element Configuration: Single; Polarity: Standard; Power Dissipation: 400mW; Current Rating: 500A; Max Operating Temperature: 125°C; REACH SVHC: No SVHC; Voltage Rating (DC): 40V; Mount: Surface Mount; Max Reverse Voltage (DC): 40V; Max Forward Surge Current (Ifsm): 5.5A; Height: 1.03mm; Package Quantity: 3000; Forward Current: 500mA; Average Rectified Current: 500mA; Weight: 0.03g; Output Current: 500mA; Contact Plating: Tin; Packaging: Tape and Reel; Width: 1.6mm; Radiation Hardening: No; Peak Non-Repetitive Surge Current: 5.5A; Max Repetitive Reverse Voltage (Vrrm): 40V; Length: 2.7mm; Lead Free: Lead Free; Min Operating Temperature: -65°C; Number of Pins: 2; Peak Reverse Current: 20uA
D3 = CMP-1055-00559-1: Dual Series Schottky Barrier Diodes, 3-Pin SOT-323, Pb-Free, Tape and Reel; Manufacturer: On Semiconductor; trr Max (ns): 5; IFSM Max (A): 0.6; ComponentLink1URL: http://www.onsemi.com/; Mounting Technology: Surface Mount; ComponentLink1Description: Manufacturer URL; ComponentLink3URL: http://www.onsemi.com/pub_link/Collateral/419-04.PDF; RoHS: TRUE; PackageVersion: Rev. N, 11/2008; Packing: Tape and Reel; PackageReference: SOT-323-3-419-04; ComponentLink2URL: http://www.onsemi.cn/pub_link/Collateral/BAT54SWT1-D.PDF; ComponentLink3Description: Package Specification; PackageDescription: 3-Pin Small Outline Transistor, Body 2 x 1.25 mm, Pitch 0.65 mm; ComponentLink2Description: Datasheet; PartNumber: BAT54SWT1G; DatasheetVersion: Rev. 10; Configuration: Dual
L1 L3 L4 = CMP-0227-00369-1: SMD Shielded Tiny Power Inductor WE-TPC, L = 3.90 µH; Inductance: 3.90 ÂµH; ComponentLink1Description: Manufacturer Link; PackageReference: WE-TPC-4818-M; PackageDescription: SMD Inductor, 2-Leads, Body 4.8 x 4.8 mm; ComponentLink2URL: http://www.we-online.de/katalog/media/pdf/7440420039.pdf; DatasheetVersion: ver 6, Aug-2010; ComponentLink2Description: Datasheet; ComponentLink1URL: http://www.we-online.com; PackageVersion: 2010
L2 = CMP-0227-00477-1: SMD Power Inductor WE-PD2, L = 10.0 µH; Inductance: 10.0 ÂµH; ComponentLink2Description: Datasheet; ComponentLink1Description: Manufacturer Link; ComponentLink1URL: http://www.we-online.com; ComponentLink2URL: http://www.we-online.de/katalog/media/pdf/74477310.pdf; PackageDescription: SMD Inductor, 2-Leads, Body 4.5 x 4.0 mm; DatasheetVersion: ver 1, Oct-2004; PackageReference: WE-PD2-S; PackageVersion: 2004
LED1 = CMP-1426-00011-1: SMD mono-color Chip LED, WL-SMCW, Red; PartNumber: 150080RS75000; Manufacturer: Wuerth Elektronik; Color: Red; PackageReference: 0805_A; ComponentLink2Description: Datasheet; ComponentLink1URL: http://www.we-online.com; ComponentLink1Description: Manufacturer URL; ComponentLink2URL: http://katalog.we-online.com/led/datasheet/150080RS75000.pdf
R9-R22 R24-R42 = CMP-2100-03671-1: as R2 on sheet MCU; Number of Pins: 2; Number of Terminations: 2; Datasheet URL: http://www.yageo.com/NewPortal/yageodocoutput?fileName=/pdf/R-Chip/PYu-RC_Group_51_RoHS_L_5.pdf; Length: 0.079inch; Package Description: 2-Pin Surface Mounted Device, Body 2 x 1.25 mm; Depth: 1.25mm; Height: 0.024inch; Military Standard: Not; Case/Package: 0805; Package Reference: 0805; RoHSCompliant: true; Lead Free: LeadFree; Packaging: TapeandReel; Package Quantity: 1; Datasheet Version: Rev. 5, 10/2016; Tolerance: 1%; Min Operating Temperature: -55degC; Voltage Rating: 150V; Composition: ThickFilm; Case Code (Imperial): 0805; Power Rating: 125mW; Width: 0.049inch; Case Code (Metric): 2012; Manufacturer URL: http://www.yageo.com/; Max Operating Temperature: 155degC; REACH SVHC: Unknown; Termination: SMD/SMT
R23 = CMP-2000-02744-1: Part Number: RR0816P-753-B-T5; Manufacturer: Susumu
U6 U8 = CMP-04918-000412-1: IC REG BUCK ADJ 2A TSOT23-6; Output Configuration: Positive; Max Input Voltage: 17V; Synchronous Rectifier: Yes; Number of Outputs: 1; Switching Frequency: 580kHz; Min Input Voltage: 4.5V; Max Output Voltage: 7V; Quiescent Current: 400uA; Min Output Voltage: 768mV; Output Type: Adjustable; Packaging: Tape and Reel; Case/Package: SOT-23-6; Lead Free: Lead Free; Mount: Surface Mount; Max Operating Temperature: 125°C; RoHS Compliant: Yes; Output Current: 2A; Min Operating Temperature: -40°C
U7 = CMP-0388-00558-1: 4-Channel LCD Bias with Fully Integrated Postive Charge Pump, 3.3 V LDO Controller, 2.7 to 5.8 V, -40 to 85 degC, 24-pin QFN (RGE24), Green (RoHS & no Sb/Br); Manufacturer: Texas Instruments; Rating: Catalog; Vin(Max)(V): 5.8; Iq(Typ)(mA): 0.7; Iout(Max)(A): 0.02; Switching Frequency(Typ)(kHz): 1600; Vin(Min)(V): 2.7; SubFamily: LCD/OLED Display Bias Solutions; Topology: Boost, Inverting Buck/Boost; ComponentLink2Description: Datasheet; PartNumber: TPS65100RGERG4; Code_JEDEC: MO-220; PackageVersion: 4204104/G; ComponentLink3URL: http://www.ti.com/litv/pdf/mpqf124f; ComponentLink2URL: http://www.ti.com/general/docs/lit/getliterature.tsp?genericPartNumber=TPS65100&fileType=pdf; Mounting Technology: Surface Mount; DatasheetVersion: SLVS496C; ComponentLink1Description: Manufacturer URL; ComponentLink1URL: http://www.ti.com/; PackageDescription: 24-Pin Plastic Flat Pack, Body 4 x 4 mm, 0.5 mm Pitch; PackageReference: RGE24-2450X2450TP; Eco-Plan: Green (RoHS & no Sb/Br); ComponentLink3Description: Package Specification
U9 = CMP-0388-00113-2: 28 V, 400 mA Switch Boost Converter for White LED Applications, 1.8 to 6 V, -40 to 85 degC, 5-pin SOT23 (DBV5), Green (RoHS & no Sb/Br); Manufacturer: Texas Instruments; Switching Frequency(Max)(kHz): 1000; Rating: Catalog; Dimming: TRUE; Iq(Typ)(mA): 0.028; Iout(Max)(A): 0.09; SubFamily: White LED Driver; Vin(Min)(V): 1.8; Vin(Max)(V): 6; PackageDescription: 5-Pin Plastic Small Outline, Body 1.60 Ãƒâ€” 2.90 mm, Pitch 0.95 mm; Eco-Plan: Green (RoHS & no Sb/Br); ComponentLink1Description: Manufacturer URL; ComponentLink1URL: http://www.ti.com/; PackageVersion: 4073253-4/K; ComponentLink2Description: Datasheet; ComponentLink2URL: http://www.ti.com/general/docs/lit/getliterature.tsp?genericPartNumber=TPS61040&fileType=pdf; Code_JEDEC: MO-178; DatasheetVersion: SLVS413F; Mounting Technology: Surface Mount; PackageReference: DBV0005A; PartNumber: TPS61040DBVR; Topology: Boost; ComponentLink3Description: Package Specification; ComponentLink3URL: http://www.ti.com/litv/pdf/mpds018i
U10 = CMP-209535-000002-1: 1A LOW DROPOUT VOLTAGE REGULATOR; RoHS Compliant: Yes

## Sheet LCD.SchDoc
size A4
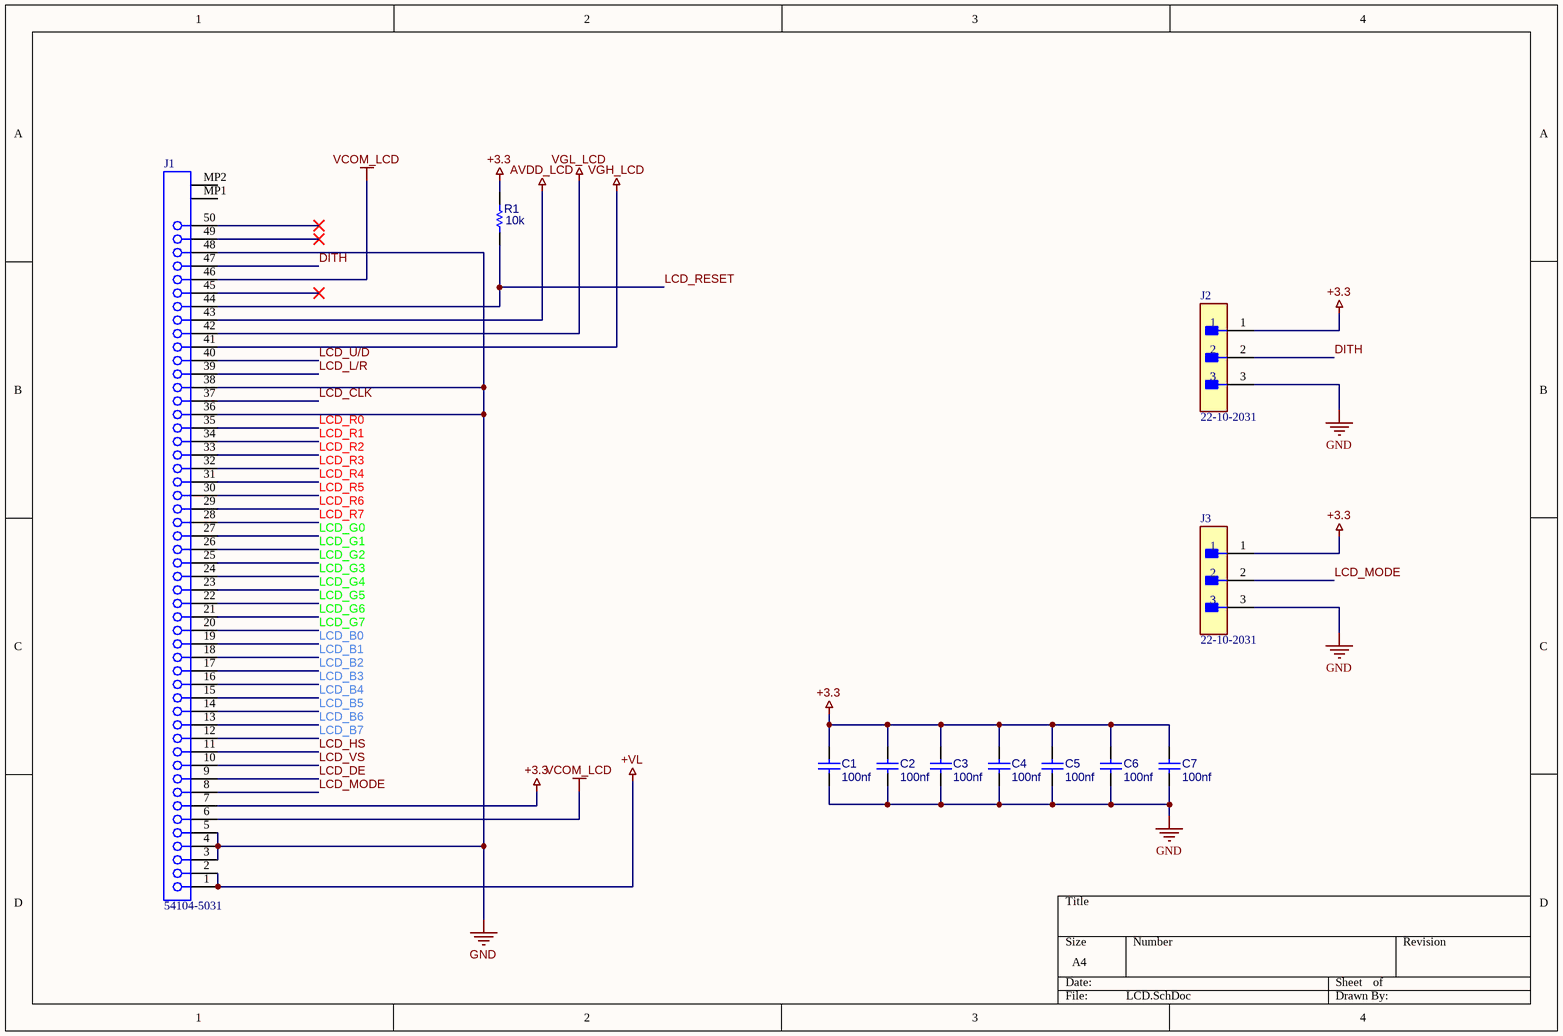
[diagram p2: LCD.SchDoc]

### Parts
C1  100nf  [CAPC2013X70X45NL10T25]
C2  100nf  [CAPC2013X70X45NL10T25]
C3  100nf  [CAPC2013X70X45NL10T25]
C4  100nf  [CAPC2013X70X45NL10T25]
C5  100nf  [CAPC2013X70X45NL10T25]
C6  100nf  [CAPC2013X70X45NL10T25]
C7  100nf  [CAPC2013X70X45NL10T25]
J1  54104-5031  [MOLX-54104-5031]
J2  22-10-2031  [FP-22-10-2031-MFG]
J3  22-10-2031  [FP-22-10-2031-MFG]
R1  10k  [RESC2013X60X35ML10T20]

### Nets
+3.3: C1.2 C2.2 C3.2 C4.2 C5.2 C6.2 C7.2 J1.7 J2.1 J3.1 R1.1
+VL: J1.1 J1.2
AVDD_LCD: J1.43
GND: C1.1 C2.1 C3.1 C4.1 C5.1 C6.1 C7.1 J1.3 J1.4 J1.5 J1.36 J1.38 J1.48 J2.3 J3.3
VCOM_LCD: J1.6 J1.46
VGH_LCD: J1.41
VGL_LCD: J1.42
DITH: J1.47 J2.2
LCD_B0: J1.19
LCD_B1: J1.18
LCD_B2: J1.17
LCD_B3: J1.16
LCD_B4: J1.15
LCD_B5: J1.14
LCD_B6: J1.13
LCD_B7: J1.12
LCD_CLK: J1.37
LCD_DE: J1.9
LCD_G0: J1.27
LCD_G1: J1.26
LCD_G2: J1.25
LCD_G3: J1.24
LCD_G4: J1.23
LCD_G5: J1.22
LCD_G6: J1.21
LCD_G7: J1.20
LCD_HS: J1.11
LCD_L/R: J1.39
LCD_MODE: J1.8 J3.2
LCD_R0: J1.35
LCD_R1: J1.34
LCD_R2: J1.33
LCD_R3: J1.32
LCD_R4: J1.31
LCD_R5: J1.30
LCD_R6: J1.29
LCD_R7: J1.28
LCD_RESET: J1.44 R1.2
LCD_U/D: J1.40
LCD_VS: J1.10

Not connected (* = marked no-connect by the designer): J1 45* 49* 50* MP1 MP2

### Library data of the parts
C1-C7 = CMP-2007-00957-1: as C8 on sheet MCU
J1 = CMP-1241-00514-1: 0.5 mm Pitch Easy-On(TM) Type FPC Connector, 2.0 mm Mated Height, Right Angle, ZIF, SMT, Top Contact, 50 Circuits, -20 to 85 degC, ELV and RoHS Compliant, Tape and Reel; Manufacturer: Molex; Voltage (Max): 50V; Stackable: No; Pitch - Mating Interface: 0.50mm; Current (Max per Contact): 0.5A; Polarized to PCB: Yes; Mated Height: 2.00mm; Material - Metal: Phosphor Bronze; Durability (mating cycles max): 20; Circuits (Loaded): 50; Entry Angle: 90degrees Angle; ComponentLink3URL: http://www.molex.com/pdm_docs/sd/541045031_sd.pdf; Packing: Tape and Reel; ComponentLink2URL: http://www.molex.com/webdocs/datasheets/pdf/en-us/0541045031_FFC_FPC_CONNECTORS.pdf; Contact Position: Top; Number of Rows: 1; ComponentLink3Description: Package Specification; PackageDescription: 50-Lead FPC Connector, Pitch 0.5 mm; PackageVersion: Rev. F, 06/2012; PartNumber: 54104-5031; ComponentLink2Description: Datasheet; PCB Locator: No; PackageReference: 54104-5031; PCB Retention: Yes; ComponentLink1Description: Manufacturer URL; ComponentLink1URL: http://www.molex.com/molex/index.jsp; RoHS: TRUE; Orientation: Right Angle; Mounting Technology: Surface Mount
J2 J3 = CMP-04776-000653-1: CONN HEADER VERT 3POS 2.54MM; Insulation Resistance: 50GR; Glow Wire Compliant: Non-compliant; Number of Contacts: 3; Max Current Rating: 4A; Voltage Rating (DC): 250V; Gender: Male; Contact Resistance: 10mR; Approvals: UL; Color: White; Radiation Hardening: No; Pitch: 2.54mm; Packaging: Bulk; Orientation: Straight; Housing Material: Nylon; Depth: 2.34mm; Flammability Rating: UL94 V-0; Number of Circuits: 3; Min Operating Temperature: 0°C; Lead Free: Lead Free; Contact Plating: Gold; Halogen Free: Low Halogen; Max Voltage Rating (AC): 250V; Length: 7.37mm; Height: 10.79mm; Current Rating: 4A; Series: KK® 4030; Contact Material: Brass; Number of Rows: 1; Housing Color: White; Voltage Rating: 250V; Package Quantity: 2000; Number of Positions: 3; Contact Type: Male Pin; Mount: Through Hole; Max Operating Temperature: 75°C; Termination: Solder; Contact Mating Length: 0.295inch
R1 = CMP-2100-03671-1: as R2 on sheet MCU; Number of Pins: 2; Number of Terminations: 2; Datasheet URL: http://www.yageo.com/NewPortal/yageodocoutput?fileName=/pdf/R-Chip/PYu-RC_Group_51_RoHS_L_5.pdf; Length: 0.079inch; Package Description: 2-Pin Surface Mounted Device, Body 2 x 1.25 mm; Depth: 1.25mm; Height: 0.024inch; Military Standard: Not; Case/Package: 0805; Package Reference: 0805; RoHSCompliant: true; Lead Free: LeadFree; Packaging: TapeandReel; Package Quantity: 1; Datasheet Version: Rev. 5, 10/2016; Tolerance: 1%; Min Operating Temperature: -55degC; Voltage Rating: 150V; Composition: ThickFilm; Case Code (Imperial): 0805; Power Rating: 125mW; Width: 0.049inch; Case Code (Metric): 2012; Manufacturer URL: http://www.yageo.com/; Max Operating Temperature: 155degC; REACH SVHC: Unknown; Termination: SMD/SMT